# EAGLE design V2 (EAGLE 9.5.1)
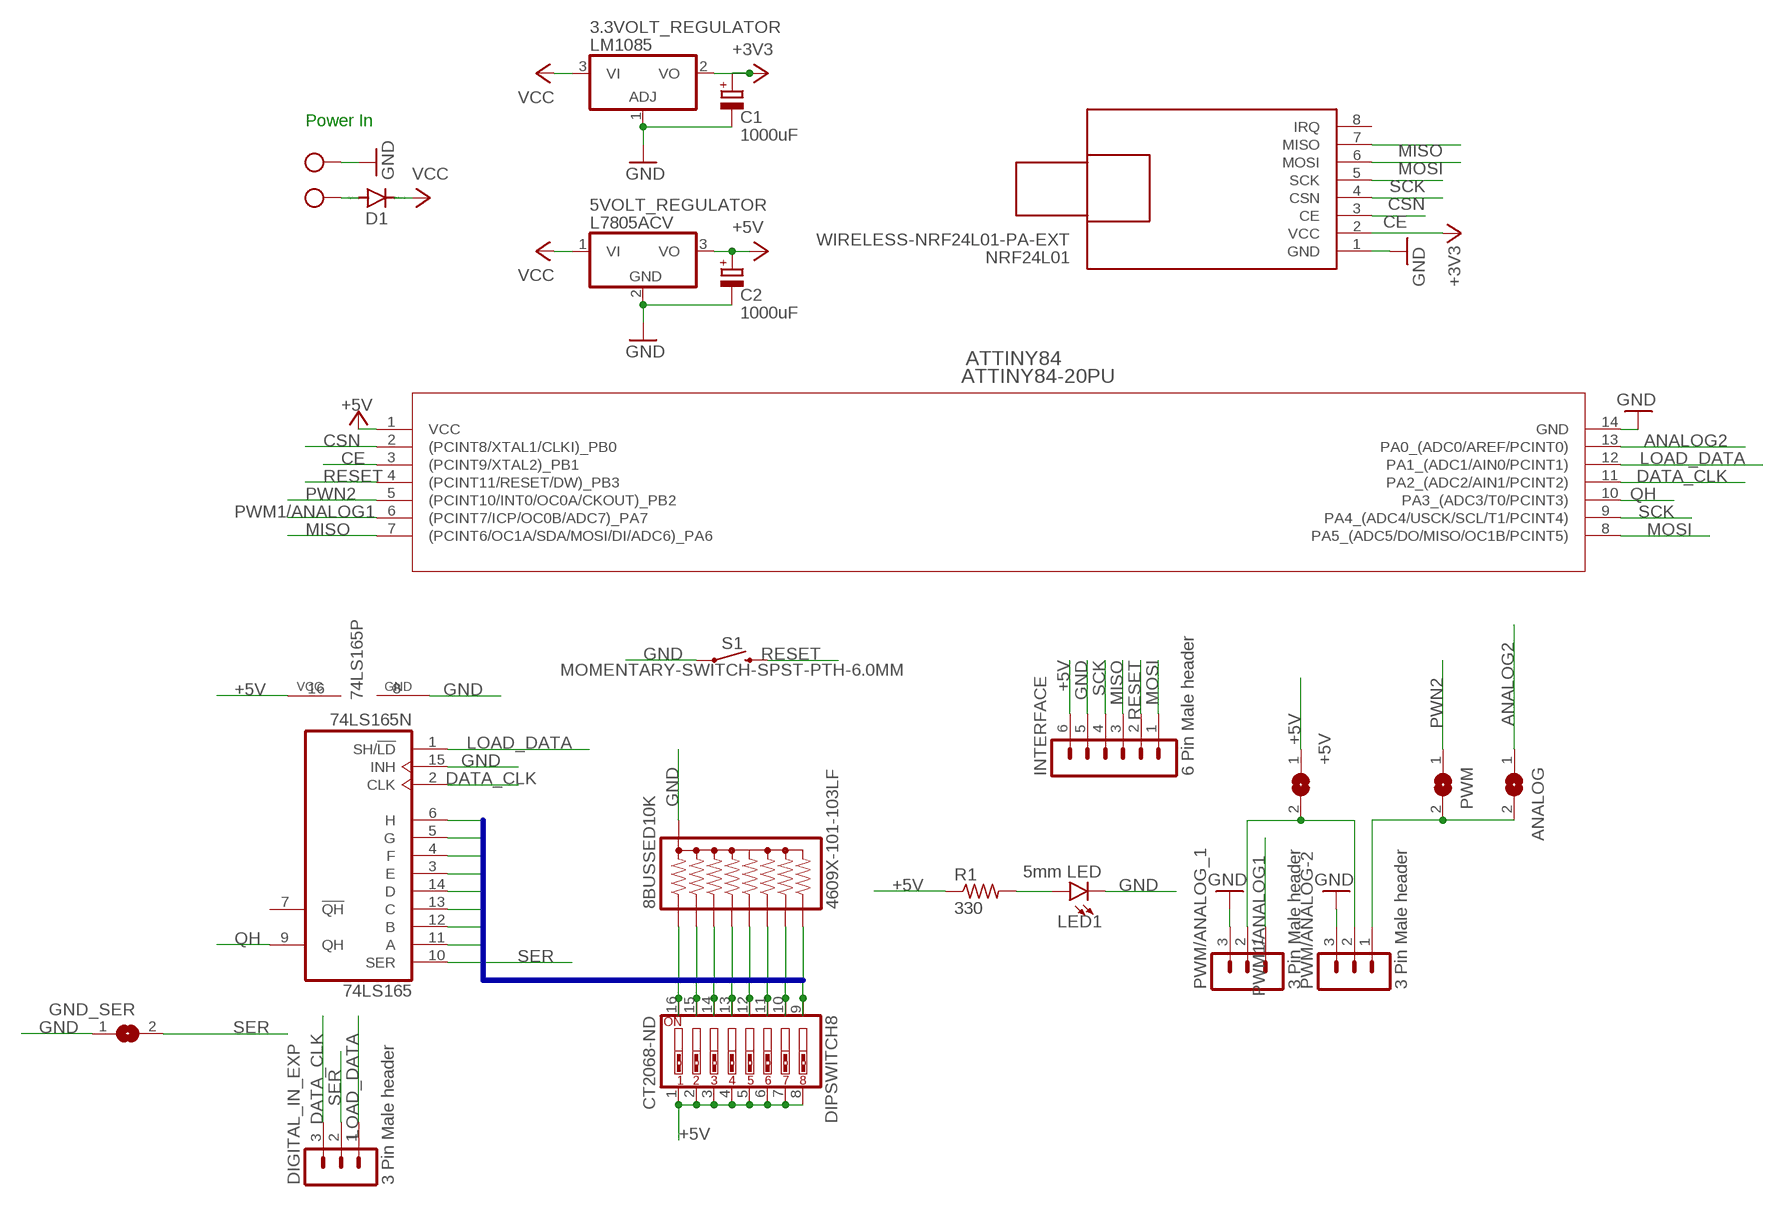
[diagram p0: schematic, sheet 1]

## Parts
3.3VOLT_REGULATOR  LM1085  MC33269T-12  [TO220V]
5VOLT_REGULATOR  L7805ACV  788TV  [TO220V]
8BUSSED10K  4609X-101-103LF  10K_BUSSED_8  [RPACK-SIP-PTH-8]
74LS165  74LS165N  [DIL16]
+5V  SJW  [SJW]
ANALOG  SJW  [SJW]
ATTINY84  ATTINY84-20PU  [14P3]
C1  1000uF  CPOL-EUE2.5-6  [E2,5-6]
C2  1000uF  CPOL-EUE2.5-6  [E2,5-6]
D1  1N5060GP  [DO15-12]
DIGITAL_IN_EXP  3 Pin Male header  MA03-1  [MA03-1]
DIPSWITCH8  CT2068-ND  SW_DIP-8  [EDG-08]
GND_SER  SJW  [SJW]
INTERFACE  6 Pin Male header  MA06-1  [MA06-1]
LED1  5mm LED  LED5MM  [LED_5MM]
NRF24L01  WIRELESS-NRF24L01-PA-EXT  [WIRELESS-NRF24L01-PA-EXT]
PWM  SJW  [SJW]
PWM/ANALOG-2  3 Pin Male header  MA03-1  [MA03-1]
PWM/ANALOG_1  3 Pin Male header  MA03-1  [MA03-1]
R1  330  R-US_0204/7  [0204/7]
S1  MOMENTARY-SWITCH-SPST-PTH-6.0MM  [TACTILE_SWITCH_PTH_6.0MM]
X1  MKDSN1,5/2-5,08  [MKDSN1,5/2-5,08]

## Nets
+3V3: 3.3VOLT_REGULATOR.2(VO) C1.+ NRF24L01.2(VCC)
+5V: 5VOLT_REGULATOR.3(VO) 74LS165.16(VCC) +5V.1 ATTINY84.1(VCC) C2.+ DIPSWITCH8.1 DIPSWITCH8.2 DIPSWITCH8.3 DIPSWITCH8.4 DIPSWITCH8.5 DIPSWITCH8.6 DIPSWITCH8.7 DIPSWITCH8.8 INTERFACE.6 R1.1
ANALOG2: ANALOG.1 ATTINY84.13(PA0_(ADC0/AREF/PCINT0))
BIT0: 8BUSSED10K.P$2 74LS165.11(A) DIPSWITCH8.16
BIT1: 8BUSSED10K.P$3 74LS165.12(B) DIPSWITCH8.15
BIT2: 8BUSSED10K.P$4 74LS165.13(C) DIPSWITCH8.14
BIT3: 8BUSSED10K.P$5 74LS165.14(D) DIPSWITCH8.13
BIT4: 8BUSSED10K.P$6 74LS165.3(E) DIPSWITCH8.12
BIT5: 8BUSSED10K.P$7 74LS165.4(F) DIPSWITCH8.11
BIT6: 8BUSSED10K.P$8 74LS165.5(G) DIPSWITCH8.10
BIT7: 8BUSSED10K.P$9 74LS165.6(H) DIPSWITCH8.9
CE: ATTINY84.3((PCINT9/XTAL2)_PB1) NRF24L01.3(CE)
CSN: ATTINY84.2((PCINT8/XTAL1/CLKI)_PB0) NRF24L01.4(CSN)
DATA_CLK: 74LS165.2(CLK) ATTINY84.11(PA2_(ADC2/AIN1/PCINT2)) DIGITAL_IN_EXP.3
GND: 3.3VOLT_REGULATOR.1(ADJ) 5VOLT_REGULATOR.2(GND) 8BUSSED10K.P$1 74LS165.8(GND) 74LS165.15(INH) ATTINY84.14(GND) C1.- C2.- GND_SER.1 INTERFACE.5 LED1.K(C) NRF24L01.1(GND) PWM/ANALOG-2.3 PWM/ANALOG_1.3 S1.1 X1.2
LOAD_DATA: 74LS165.1(SH/!LD) ATTINY84.12(PA1_(ADC1/AIN0/PCINT1)) DIGITAL_IN_EXP.1
MISO: ATTINY84.7((PCINT6/OC1A/SDA/MOSI/DI/ADC6)_PA6) INTERFACE.3 NRF24L01.7(MISO)
MOSI: ATTINY84.8(PA5_(ADC5/DO/MISO/OC1B/PCINT5)) INTERFACE.1 NRF24L01.6(MOSI)
N$1: +5V.2 PWM/ANALOG-2.2 PWM/ANALOG_1.2
N$2: ANALOG.2 PWM.2 PWM/ANALOG-2.1
N$3: LED1.A R1.2
N$7: D1.A X1.1
PWM1/ANALOG1: ATTINY84.6((PCINT7/ICP/OC0B/ADC7)_PA7) PWM/ANALOG_1.1
PWN2: ATTINY84.5((PCINT10/INT0/OC0A/CKOUT)_PB2) PWM.1
QH: 74LS165.9(QH) ATTINY84.10(PA3_(ADC3/T0/PCINT3))
RESET: ATTINY84.4((PCINT11/RESET/DW)_PB3) INTERFACE.2 S1.3
SCK: ATTINY84.9(PA4_(ADC4/USCK/SCL/T1/PCINT4)) INTERFACE.4 NRF24L01.5(SCK)
SER: 74LS165.10(SER) DIGITAL_IN_EXP.2 GND_SER.2
VCC: 3.3VOLT_REGULATOR.3(VI) 5VOLT_REGULATOR.1(VI) D1.C
Unconnected: 74LS165.7(!QH) NRF24L01.8(IRQ)

## Buses
DATA:BIT0,BIT1,BIT2,BIT3,BIT4,BIT5,BIT6,BIT7

## Notes on the sheet
- Power In

## Library data of the parts
3.3VOLT_REGULATOR = linear:MC33269?*: Adjustable Output Low Dropout Voltage Regulator 800 mA Source: http://www.onsemi.com/pub/Collateral/MC33269-D.PDF
5VOLT_REGULATOR = linear:78*: Positive VOLTAGE REGULATOR Source: http://cache.national.com/ds/LM/LM78L05.pdf http://www.fairchildsemi.com/ds/LM/LM7805.pdf
8BUSSED10K = SparkFun-Resistors:10K_BUSSED_8: 10K BUSSED RESISTORS 8
74LS165 = 74xx-us:74*165: 8-bit parallel load SHIFT REGISTER
+5V ANALOG GND_SER PWM = jumper:SJ: SMD solder JUMPER
ATTINY84 = ATTINY84:ATTINY84-20PU; MANUFACTURER_PART_NUMBER: ATTINY8420PU; VENDOR: Atmel
C1 C2 = rcl:CPOL-EU: POLARIZED CAPACITOR, European symbol; SPICEPREFIX: C
D1 = diode:1N5060GP: DIODE controlled avalanche rectifier
DIGITAL_IN_EXP PWM/ANALOG-2 PWM/ANALOG_1 = test:MA03-1: PIN HEADER; OC_FARNELL: unknown; OC_NEWARK: unknown
DIPSWITCH8 = special:SW_DIP-8: DIP SWITCH
INTERFACE = test:MA06-1: PIN HEADER; OC_FARNELL: unknown; OC_NEWARK: unknown
LED1 = SparkFun-LED:LED: LED (Generic) Standard schematic elements and footprints for 5mm, 3mm, 1206, and 0603 sized LEDs. Generic LEDs with no color specified.
NRF24L01 = NEF24L01-Full:WIRELESS-NRF24L01-PA-EXT: 2.4 GHz Wireless Module based on NRF24L01 chip with preamplifier and external antenna Click here to find device on ebay.com <http://www.ebay.com/sch/nrf24l01+pa+lna+sma>
R1 = rcl:R-US_: RESISTOR, American symbol; SPICEPREFIX: R
S1 = SparkFun-Switches:MOMENTARY-SWITCH-SPST: Momentary Switch (Pushbutton) - SPST Normally-open (NO) SPST momentary switches (buttons, pushbuttons). Variants PTH-12MM - 12mm square, through-hole Momentary Pushbutton Switch - 12mm Square <https://www.sparkfun.com/products/9190> (COM-09190) PTH-6.0MM, PTH-6.0MM-KIT - 6.0mm square, through-hole Mini Pushbutton Switch <https://www.sparkfun.com/products/97> (COM-00097) KIT package intended for soldering kit's - only one side of pads' copper is exposed. PTH-RIGHT-ANGLE-KIT - Right-angle, through-hole Right Angle Tactile Button <https://www.sparkfun.com/products/10791> - Used on SparkFun BigTime Watch Kit <https://www.sparkfun.com/products/11734> SMD-12MM - 12mm square, surface-mount Tactile Button - SMD (12mm) <https://www.sparkfun.com/products/12993> (COM-12993) Used on SparkFun PicoBoard <https://www.sparkfun.com/products/11888> SMD-4.5MM - 4.5mm Square Trackball Switch Used on SparkFun Blackberry Trackballer Breakout <https://www.sparkfun.com/products/13169> SMD-4.6MMX2.8MM - 4.60mm x 2.80mm, surface mount Used on SparkFun SAMD21 Mini Breakout <https://www.sparkfun.com/products/13664> SMD-5.2MM, SMD-5.2-REDUNDANT - 5.2mm square, surface-mount Mini Pushbutton Switch - SMD <https://www.sparkfun.com/products/8720> (COM-08720) Used on Arduino Pro Mini <https://www.sparkfun.com/products/11114> REDUNDANT package connects both switch circuits together SMD-6.0X3.5MM - 6.0 x 3.5mm, surface mount Momentary Reset Switch SMD <https://www.sparkfun.com/products/8229> (COM-08229) SMD-6.2MM-TALL - 6.2mm square, surface mount Tactile Button - SMD (6mm) <https://www.sparkfun.com/products/12992> Used on SparkFun Digital Sandbox <https://www.sparkfun.com/products/12651> SMD-RIGHT-ANGLE - Right-angle, surface mount Used on SparkFun Block for Intel® Edison - Arduino <https://www.sparkfun.com/products/13036>; PROD_ID: SWCH-08441; SF_SKU: COM-00097
X1 = con-phoenix-508:MKDSN1,5/2-5,08: MKDSN 1,5/ 2-5,08 Printklemme Nennstrom: 13,5 A Nennspannung: 250 V Rastermaß: 5,08 mm Polzahl: 2 Anschlussart: Schraubanschluss Montage: Löten Anschlussrichtung Leiter/Platine: 0 ° Artikelnummer: 1729128 Source: http://eshop.phoenixcontact.com .. 1729128.pdf

## Board
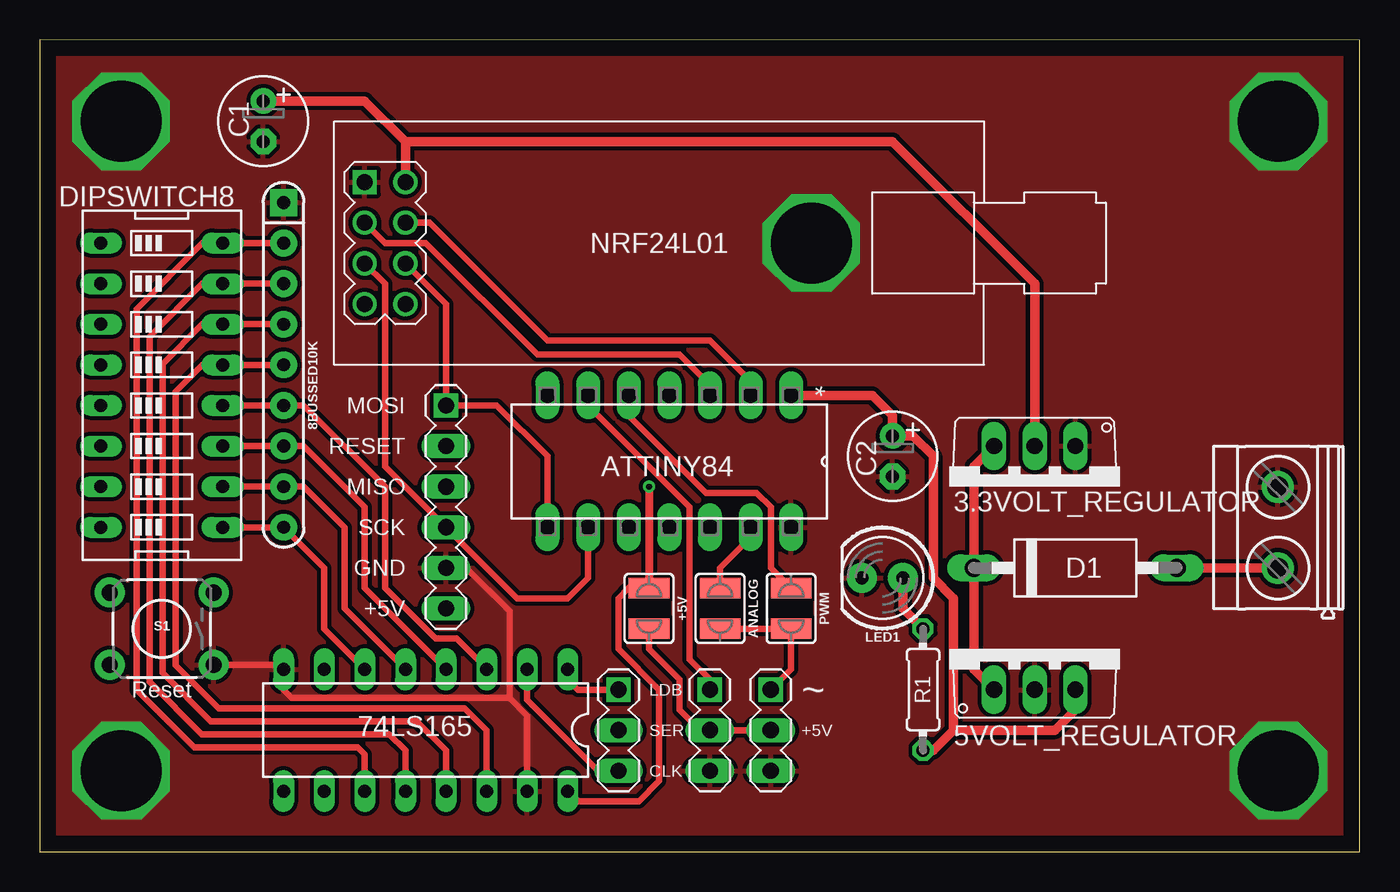
[diagram p1: board, top side]
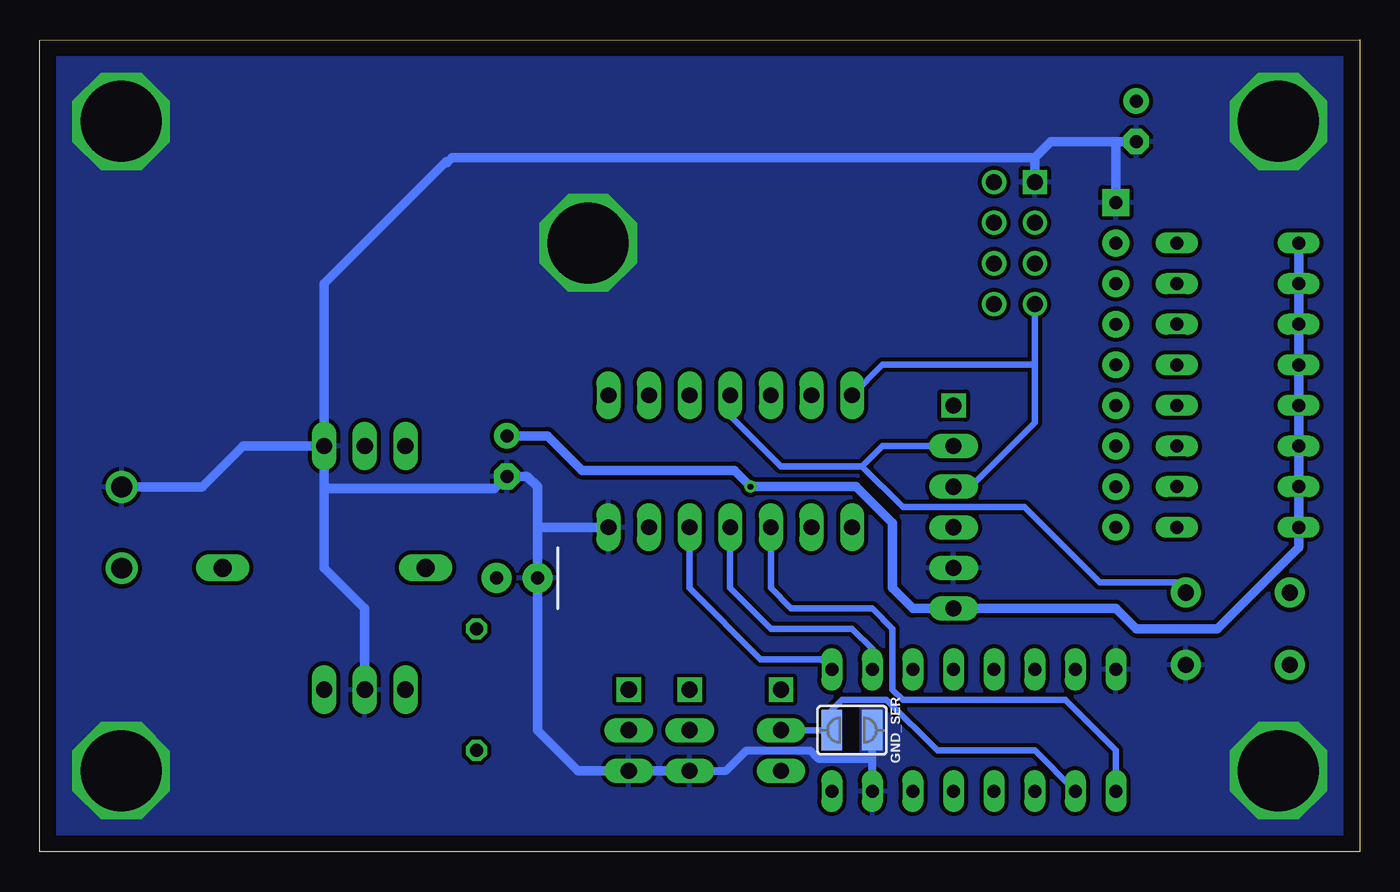
[diagram p2: board, bottom side, seen from below]

Size 82.55 x 50.81 mm. Coordinates in mm from the lower left corner, seen from the top.
Outline: 0,0 82.55,0 82.55,50.8 0,50.81 0,0
Copper layers (1*16): Top 0.035mm / dielectric 1.5mm / Bottom 0.035mm
Design rules "default *": minimum track width 6mil, minimum drill 0.35mm, track to track 10mil, track to pad 10mil, pad to pad 6mil, via to via 6mil, smd to smd 6mil, copper to edge 40mil, drill to drill 6mil, minimum pad ring 10mil, minimum via ring 8mil, stop-mask expansion 4mil, vias tented up to drill 0mil, thermal gap 10mil

### Footprints (pad centres in the part's own frame; a part is rotated, then mirrored left to right if it is on the bottom)
TO220V = drill 1.016 long: 1 -2.54,-2.54; 2 0,-2.54; 3 2.54,-2.54
RPACK-SIP-PTH-8 = drill 0.8 pad 1.676 square: P$1 0,0 | drill 0.8 pad 1.676: P$2 0,-2.54; P$3 0,-5.08; P$4 0,-7.62; P$5 0,-10.16; P$6 0,-12.7; P$7 0,-15.24; P$8 0,-17.78; P$9 0,-20.32
DIL16 = drill 0.813 long: 1 -8.89,-3.81; 2 -6.35,-3.81; 3 -3.81,-3.81; 4 -1.27,-3.81; 5 1.27,-3.81; 6 3.81,-3.81; 7 6.35,-3.81; 8 8.89,-3.81; 9 8.89,3.81; 10 6.35,3.81; 11 3.81,3.81; 12 1.27,3.81; 13 -1.27,3.81; 14 -3.81,3.81; 15 -6.35,3.81; 16 -8.89,3.81
SJW = smd 1.27 x 2.54: 1 -1.27,0; 2 1.27,0
14P3 = drill 0.991 pad 1.499 long: 1 -8.255,15.24; 2 -8.255,12.7; 3 -8.255,10.16; 4 -8.255,7.62; 5 -8.255,5.08; 6 -8.255,2.54; 7 -8.255,0; 8 0,0; 9 0,2.54; 10 0,5.08; 11 0,7.62; 12 0,10.16; 13 0,12.7; 14 0,15.24
E2,5-6 = drill 0.813 pad 1.6: + -1.27,0 | drill 0.813 pad 1.6 octagon: - 1.27,0
DO15-12 = drill 1.118 long: A 6.35,0; C -6.35,0
MA03-1 = drill 1.016 square: 1 -2.54,0 | drill 1.016 long: 2 0,0; 3 2.54,0
EDG-08 = drill 0.813 long: 1 -8.89,-3.81; 2 -6.35,-3.81; 3 -3.81,-3.81; 4 -1.27,-3.81; 5 1.27,-3.81; 6 3.81,-3.81; 7 6.35,-3.81; 8 8.89,-3.81; 9 8.89,3.81; 10 6.35,3.81; 11 3.81,3.81; 12 1.27,3.81; 13 -1.27,3.81; 14 -3.81,3.81; 15 -6.35,3.81; 16 -8.89,3.81
MA06-1 = drill 1.016 square: 1 -6.35,0 | drill 1.016 long: 2 -3.81,0; 3 -1.27,0; 4 1.27,0; 5 3.81,0; 6 6.35,0
LED_5MM = drill 0.813 pad 1.88: A -1.27,0; K 1.27,0
WIRELESS-NRF24L01-PA-EXT = drill 1 square: 1 -18.415,3.81 | drill 1: 2 -15.875,3.81; 3 -18.415,1.27; 4 -15.875,1.27; 5 -18.415,-1.27; 6 -15.875,-1.27; 7 -18.415,-3.81; 8 -15.875,-3.81
0204/7 = drill 0.813 octagon: 1 -3.81,0; 2 3.81,0
TACTILE_SWITCH_PTH_6.0MM = drill 1.016 pad 1.88: 1 -3.251,2.261; 2 3.251,2.261; 3 -3.251,-2.261; 4 3.251,-2.261
MKDSN1,5/2-5,08 = drill 1.3 pad 2: 1 -2.561,0.025; 2 2.519,0.025

### Placement (x,y rotation side)
3.3VOLT_REGULATOR  62.23,22.86 180 top
5VOLT_REGULATOR  62.23,12.7 0 top
8BUSSED10K  15.24,40.64 0 top
74LS165  24.13,7.62 180 top
+5V  38.1,15.24 270 top
ANALOG  42.55,15.24 270 top
ATTINY84  31.75,20.32 270 top
C1  13.97,45.72 270 top
C2  53.34,24.77 270 top
D1  64.77,17.78 0 top
DIGITAL_IN_EXP  36.2,7.62 270 top
DIPSWITCH8  7.62,29.21 270 top
GND_SER  31.75,7.62 180 bottom
INTERFACE  25.4,21.59 270 top
LED1  52.7,17.14 180 top
NRF24L01  38.73,38.1 0 top
PWM  46.99,15.24 270 top
PWM/ANALOG-2  45.72,7.62 270 top
PWM/ANALOG_1  41.91,7.62 270 top
R1  55.24,10.16 90 top
S1  7.62,13.97 180 top
X1  77.47,20.32 90 top

### Tracks (layer width: path | path; a pad name or v marks a point on that pad's centre or on a via)
+3V3
  Top 0.61: 3.3VOLT_REGULATOR.2 62.23,35.56 53.34,44.45 22.86,44.45 | 22.86,44.45 20.32,46.99 C1.+ | NRF24L01.2 22.86,44.45
+5V  (via drill 0.35)
  Top 0.406: 74LS165.16 33.66,3.17 37.47,3.17 38.73,4.45 38.73,10.16 36.2,12.7 36.2,15.88 36.83,16.51 +5V.1
  Top 0.508: v38.1,22.86 +5V.1
  Top 0.61: ATTINY84.1 52.07,28.57 53.34,27.3 C2.+ 54.61,26.04 55.88,24.77 55.88,17.14 57.15,15.88 57.15,7.62 | 5VOLT_REGULATOR.3 64.77,8.89 63.5,7.62 57.15,7.62 | R1.1 55.88,6.35 57.15,7.62
  Bottom 0.61: DIPSWITCH8.1 DIPSWITCH8.2 DIPSWITCH8.3 DIPSWITCH8.4 DIPSWITCH8.5 DIPSWITCH8.6 DIPSWITCH8.7 DIPSWITCH8.8 3.81,19.05 8.89,13.97 13.97,13.97 15.24,15.24 INTERFACE.6 27.94,15.24 29.21,16.51 29.21,20.57 31.5,22.86 v38.1,22.86 39.12,23.88 48.64,23.88 50.8,26.04 C2.+
ANALOG2
  Top 0.406: ATTINY84.13 44.45,19.68 42.55,17.78 ANALOG.1
BIT0
  Top 0.406: 8BUSSED10K.P$2 DIPSWITCH8.16 10.16,38.1 6.04,33.98 6.04,10.15 9.65,6.55 19.86,6.55 20.32,6.1 74LS165.11
BIT1
  Top 0.406: 8BUSSED10K.P$3 DIPSWITCH8.15 10.16,35.56 6.86,32.26 6.86,10.64 10.13,7.37 21.84,7.37 22.86,6.35 74LS165.12
BIT2
  Top 0.406: 8BUSSED10K.P$4 DIPSWITCH8.14 10.16,33.02 7.67,30.53 7.67,11.2 10.69,8.18 23.57,8.18 25.4,6.35 74LS165.13
BIT3
  Top 0.406: 8BUSSED10K.P$5 DIPSWITCH8.13 10.16,30.48 8.48,28.8 8.48,11.68 11.18,8.99 26.57,8.99 27.94,7.62 74LS165.14
BIT4
  Top 0.406: DIPSWITCH8.12 8BUSSED10K.P$6 16.51,27.94 21.59,22.86 21.59,16.51 24.74,13.36 26.07,13.36 27.94,11.49 74LS165.3
BIT5
  Top 0.406: DIPSWITCH8.11 8BUSSED10K.P$7 16.51,25.4 20.32,21.59 20.32,16.51 74LS165.4
BIT6
  Top 0.406: DIPSWITCH8.10 8BUSSED10K.P$8 16.51,22.86 19.05,20.32 19.05,15.24 74LS165.5
BIT7
  Top 0.406: DIPSWITCH8.9 8BUSSED10K.P$9 17.78,17.78 17.78,13.97 74LS165.6
CE
  Top 0.406: NRF24L01.3 21.59,38.1 24.13,38.1 31.11,31.11 40.01,31.11 41.91,29.21 ATTINY84.3
CSN
  Top 0.406: NRF24L01.4 24.38,39.37 31.75,32 41.91,32 44.45,29.46 ATTINY84.2
DATA_CLK
  Top 0.406: 74LS165.2 30.48,9.53 34.92,5.08 DIGITAL_IN_EXP.3
  Bottom 0.406: 74LS165.2 30.48,12.7 31.75,13.97 36.83,13.97 39.37,16.51 ATTINY84.11
GND  (via drill 5.08)
  Top 0.406: S1.1 14.96,11.71 74LS165.8 15.24,10.16 15.75,9.65 29.36,9.65 | INTERFACE.5 26.67,17.78 29.36,15.09 29.36,9.65 | 74LS165.15 30.48,8.53 29.36,9.65
  Bottom 0.508: 74LS165.15 30.48,5.84 | 30.48,5.84 30.48,6.86 | PWM/ANALOG_1.3 39.62,5.08 38.35,6.35 34.37,6.35 33.87,5.84 30.48,5.84
  Bottom 0.61: 3.3VOLT_REGULATOR.1 64.77,22.73 | 64.77,22.73 64.77,17.78 62.23,15.24 5VOLT_REGULATOR.2 | 3.3VOLT_REGULATOR.1 69.85,25.4 72.41,22.84 X1.2 | 64.77,22.73 54.1,22.73 C2.- 52.07,23.5 51.44,22.86 51.44,20.32 | C1.- 15.24,44.45 | 20.32,43.43 NRF24L01.1 | 20.32,43.43 19.3,44.45 15.24,44.45 | 8BUSSED10K.P$1 15.24,44.45 | 3.3VOLT_REGULATOR.1 64.77,35.56 57.15,43.18 57.09,43.12 56.78,43.43 20.32,43.43 | PWM/ANALOG_1.3 PWM/ANALOG-2.3 48.9,5.08 51.44,7.62 LED1.K 51.44,20.32 | ATTINY84.14 51.44,20.32
  other vias: 5.08,45.72 5.08,5.08 77.47,5.08 77.47,45.72 48.26,38.1
  pour Top: 0,0 82.55,0 82.55,50.8 0,50.8
  pour Bottom: 0,50.8 0,0 82.55,0 82.55,50.8
LOAD_DATA
  Top 0.406: 74LS165.1 33.02,10.79 33.66,10.16 DIGITAL_IN_EXP.1
  Bottom 0.406: ATTINY84.12 41.91,16.51 37.47,12.06 33.66,12.06 74LS165.1
MISO
  Bottom 0.406: INTERFACE.3 24.33,22.86 20.32,26.87 20.32,30.48 | ATTINY84.7 29.84,30.49 20.33,30.49 20.32,30.48 | NRF24L01.7 20.32,30.48
MOSI
  Top 0.406: ATTINY84.8 31.75,24.77 28.57,27.94 INTERFACE.1 25.4,34.29 NRF24L01.6
N$1
  Top 0.406: PWM/ANALOG-2.2 PWM/ANALOG_1.2 41.27,7.62 40.01,8.89 40.01,10.79 38.1,12.7 +5V.2
N$2
  Top 0.406: PWM/ANALOG-2.1 46.99,11.43 PWM.2 ANALOG.2
N$3
  Top 0.61: LED1.A 53.98,15.24 R1.2
N$7
  Top 0.61: D1.A 77.42,17.78 X1.1
PWM1/ANALOG1
  Top 0.406: PWM/ANALOG_1.1 41.91,10.79 40.64,12.06 40.64,21.59 34.29,27.94 ATTINY84.6
PWN2
  Top 0.406: ATTINY84.5 36.83,27.3 41.66,22.48 44.83,22.48 45.72,21.59 45.72,17.78 PWM.1
QH
  Bottom 0.406: 74LS165.9 15.24,6.35 18.41,9.53 28.57,9.53 29.21,10.16 29.21,13.97 30.48,15.24 35.56,15.24 36.83,16.51 ATTINY84.10
RESET
  Bottom 0.406: S1.3 11.51,16.87 16.23,16.87 20.95,21.59 28.57,21.59 31.11,24.13 | ATTINY84.4 39.37,27.3 36.2,24.13 31.11,24.13 | 31.11,24.13 29.84,25.4 INTERFACE.2
SCK
  Top 0.406: NRF24L01.5 21.59,35.56 21.59,24.13 INTERFACE.4 29.84,15.88 33.02,15.88 34.29,17.14 ATTINY84.9
SER
  Bottom 0.406: 74LS165.10 20.32,6.35 26.42,6.35 29.59,9.53 32.38,9.53 33.02,8.89 GND_SER.2 DIGITAL_IN_EXP.2
VCC
  Top 0.61: 3.3VOLT_REGULATOR.3 58.42,24.13 D1.C 58.42,11.43 5VOLT_REGULATOR.1

### Text on the board
tNames: MOSI | RESET | MISO | SCK | GND | +5V | Reset | LDB | ~ | SER | +5V | CLK | ⏚